# Altium schematic sheet Sheet1.SchDoc
size A3
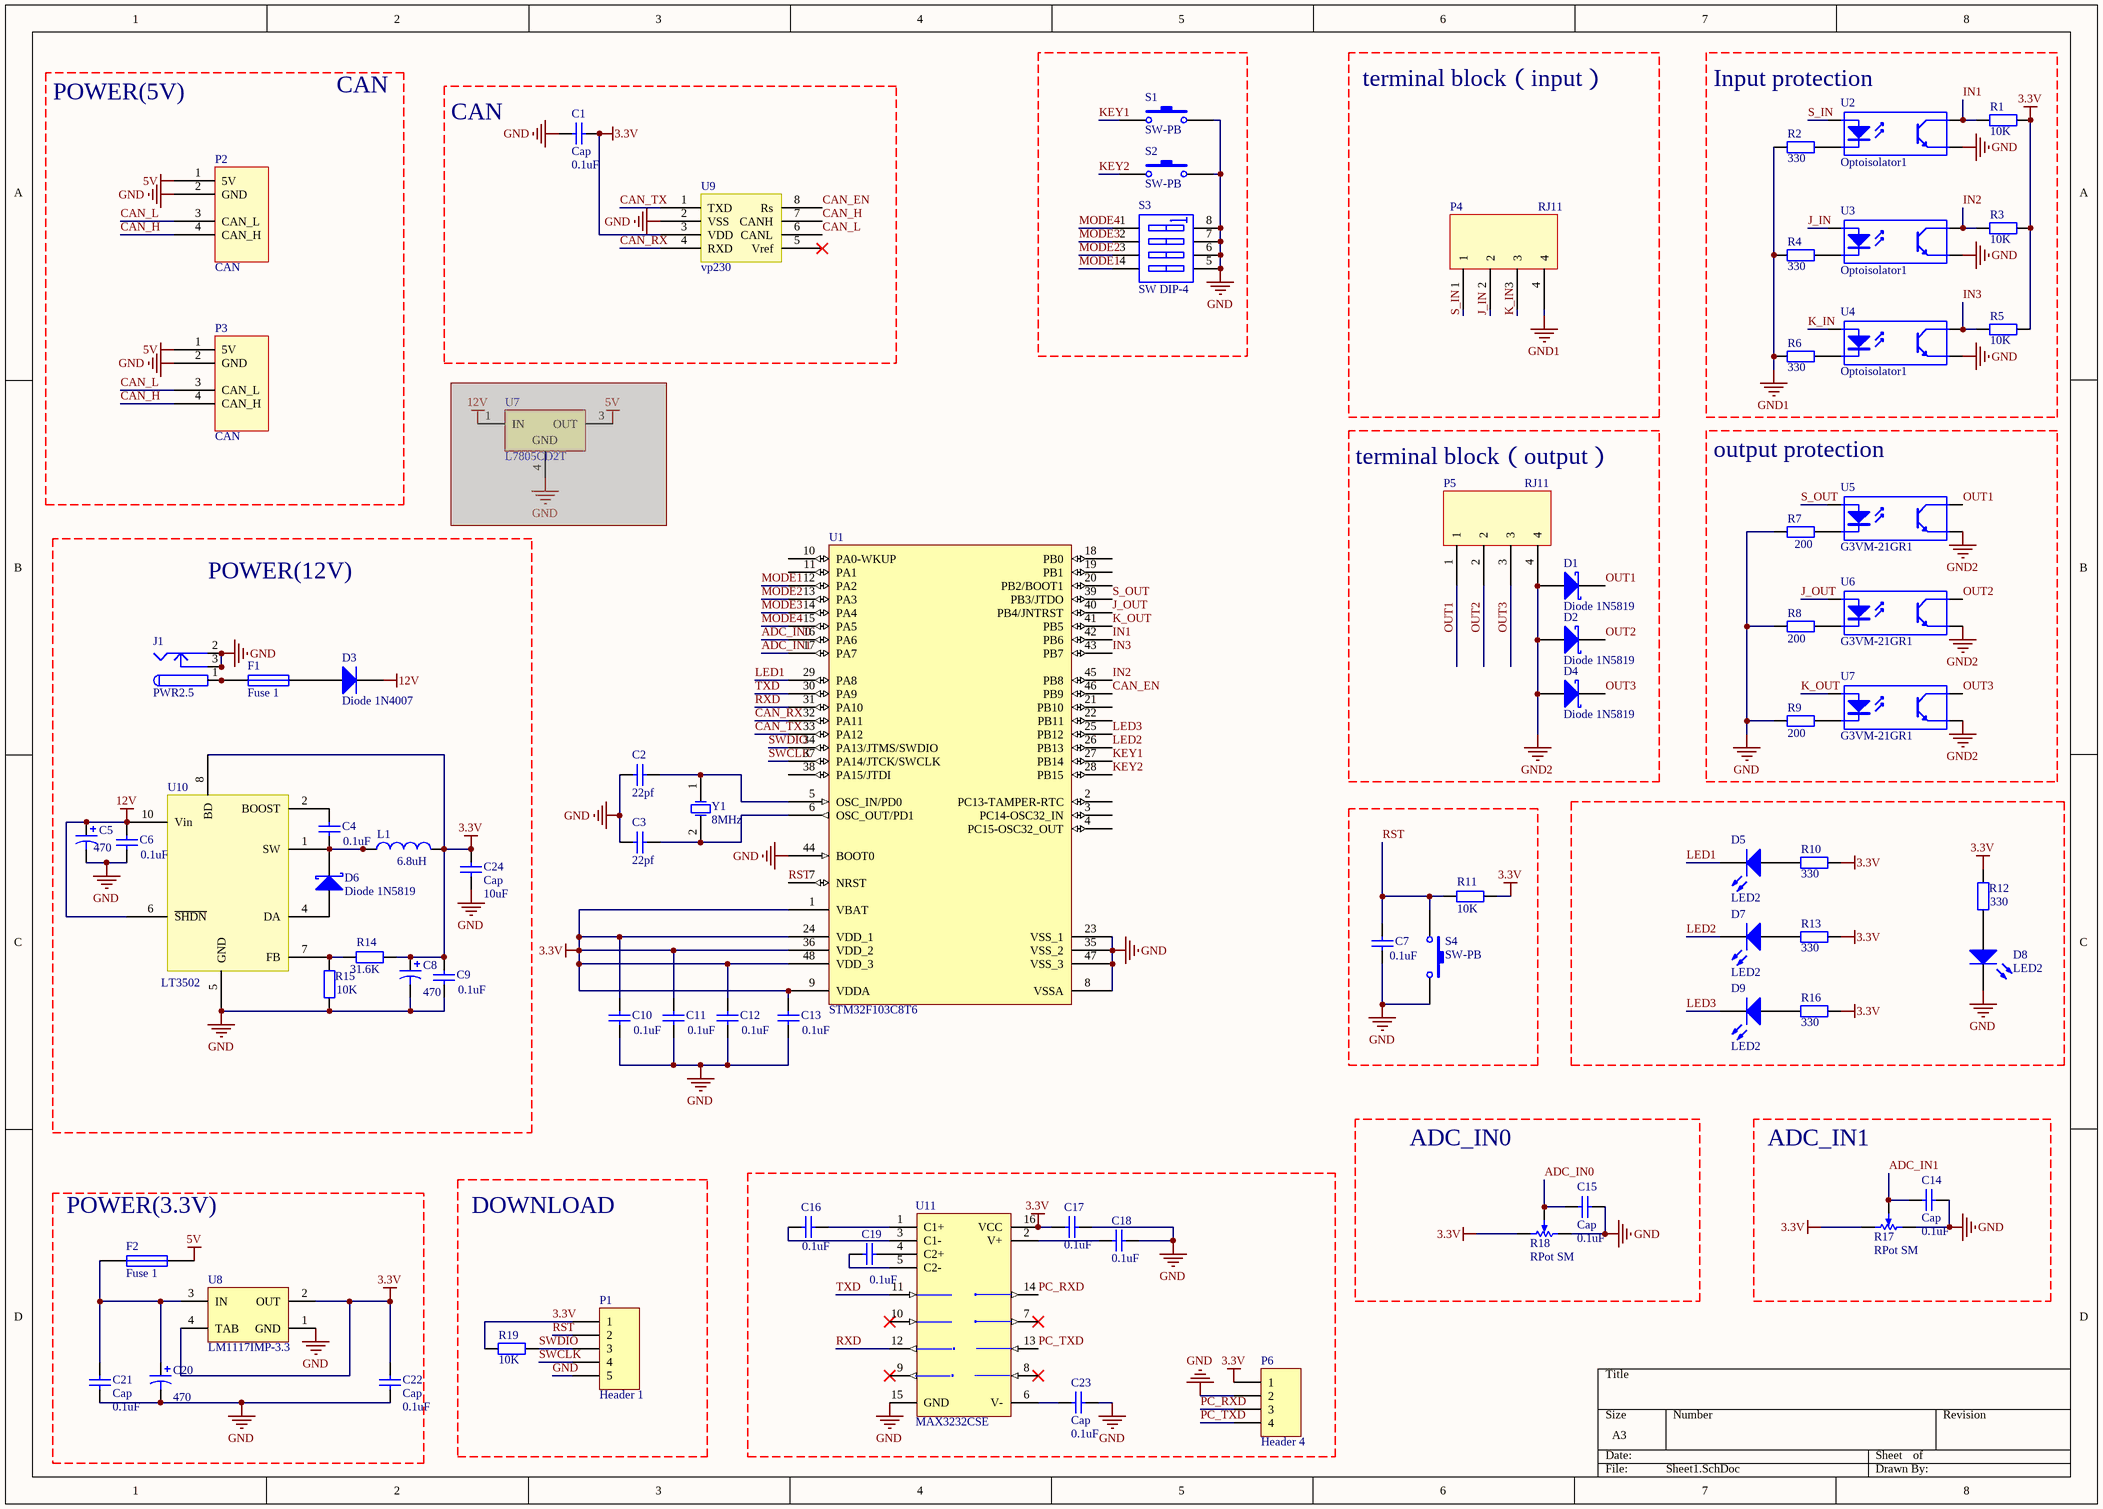
[diagram p0: Sheet1.SchDoc]

## Parts
(Parts that share a designator on the sheet are numbered #1, #2 ... from top to bottom, then left to right.)
C1  Cap  value 0.1uF  [0805]
C2  value 22pf  [0805]  (hidden comment: Cap)
C3  value 22pf  [0805]  (hidden comment: Cap)
C4  value 0.1uF  [0805]  (hidden comment: Cap)
C5  value 470  [CAP]  (hidden comment: Cap Pol1)
C6  value 0.1uF  [0805]  (hidden comment: Cap)
C7  value 0.1uF  [0805]  (hidden comment: Cap)
C8  value 470  [CAP]  (hidden comment: Cap Pol1)
C9  value 0.1uF  [0805]  (hidden comment: Cap)
C10  value 0.1uF  [0805]  (hidden comment: Cap)
C11  value 0.1uF  [0805]  (hidden comment: Cap)
C12  value 0.1uF  [0805]  (hidden comment: Cap)
C13  value 0.1uF  [0805]  (hidden comment: Cap)
C14  Cap  value 0.1uF  [0805]
C15  Cap  value 0.1uF  [0805]
C16  value 0.1uF  [0805]  (hidden comment: Cap)
C17  value 0.1uF  [0805]  (hidden comment: Cap)
C18  value 0.1uF  [0805]  (hidden comment: Cap)
C19  value 0.1uF  [0805]  (hidden comment: Cap)
C20  value 470  [CAP]  (hidden comment: Cap Pol1)
C21  Cap  value 0.1uF  [0805]
C22  Cap  value 0.1uF  [0805]
C23  Cap  value 0.1uF  [0805]
C24  Cap  value 10uF  [1206]
D1  Diode 1N5819  [1N5819]
D2  Diode 1N5819  [1N5819]
D3  Diode 1N4007  [1N4007]
D4  Diode 1N5819  [1N5819]
D5  LED2  [0805_polar]
D6  Diode 1N5819  [1N5819]
D7  LED2  [0805_polar]
D8  LED2  [0805_polar]
D9  LED2  [0805_polar]
F1  Fuse 1  [1812]
F2  Fuse 1  [1812]
J1  PWR2.5  [KLD-0202]
L1  value 6.8uH  [SLF6025]  (hidden comment: Inductor)
P1  Header 1  [HDR1X5]
P2  CAN  [RJ11]
P3  CAN  [RJ11]
P4  RJ11  [RJ11]
P5  RJ11  [RJ11]
P6  Header 4  [HDR1X4]
R1  value 10K  [0805]  (hidden comment: Res2)
R2  value 330  [0805]  (hidden comment: Res2)
R3  value 10K  [0805]  (hidden comment: Res2)
R4  value 330  [0805]  (hidden comment: Res2)
R5  value 10K  [0805]  (hidden comment: Res2)
R6  value 330  [0805]  (hidden comment: Res2)
R7  value 200  [0805]  (hidden comment: Res2)
R8  value 200  [0805]  (hidden comment: Res2)
R9  value 200  [0805]  (hidden comment: Res2)
R10  value 330  [0805]  (hidden comment: Res2)
R11  value 10K  [0805]  (hidden comment: Res2)
R12  value 330  [0805]  (hidden comment: Res2)
R13  value 330  [0805]  (hidden comment: Res2)
R14  value 31.6K  [0805]  (hidden comment: Res2)
R15  value 10K  [0805]  (hidden comment: Res2)
R16  value 330  [0805]  (hidden comment: Res2)
R17  RPot SM  [VR]
R18  RPot SM  [VR]
R19  value 10K  [0805]  (hidden comment: Res2)
S1  SW-PB  [key]
S2  SW-PB  [key]
S3  SW DIP-4  [DIP-8]
S4  SW-PB  [key]
U1  STM32F103C8T6  [LQFP48_N]
U2  Optoisolator1  [SOP4]
U3  Optoisolator1  [SOP4]
U4  Optoisolator1  [SOP4]
U5  G3VM-21GR1  [G3VM-21GR1]
U6  G3VM-21GR1  [G3VM-21GR1]
U7#1  L7805CD2T  [TO-263]  (masked out: inside a compile mask, not in the netlist)
U7#2  G3VM-21GR1  [G3VM-21GR1]
U8  LM1117IMP-3.3  [MP04A_N]
U9  vp230  [SOP8_N]
U10  LT3502  [LT3502]
U11  MAX3232CSE  [NSO16_N]
Y1  8MHz  [XTAL]

## Nets
3.3V: C1.1 C8.1 C9.2 C10.1 C11.1 C12.1 C13.1 C17.1 C22.1 C24.1 L1.2 P1.1 P6.1 R1.1 R3.2 R5.2 R10.1 R11.2 R12.1 R13.1 R14.2 R16.1 R17.1(+) R18.1(+) R19.1 U1.1(VBAT) U1.9(VDDA) U1.24(VDD_1) U1.36(VDD_2) U1.48(VDD_3) U8.2(OUT) U8.4(TAB) U9.3(VDD) U10.8(BD) U11.16(VCC)
5V: F2.1 P2.1(5V) P3.1(5V)
12V: C5.1 C6.2 D3.2(K) U10.6(~{SHDN}) U10.10(NC)
GND: C1.2 C2.2 C3.2 C5.2 C6.1 C7.1 C8.2 C9.1 C10.2 C11.2 C12.2 C13.2 C14.2 C15.2 C17.2 C18.2 C20.2 C21.2 C22.2 C23.2 C24.2 D8.2(K) J1.2 J1.2A J1.2B J1.3 J1.3A J1.3B P1.5 P2.2(GND) P3.2(GND) P6.2 R7.1 R8.1 R9.1 R15.1 R17.2(-) R18.2(-) S1.2 S2.2 S3.5(B4) S3.6(B3) S3.7(B2) S3.8(B1) S4.2 U1.8(VSSA) U1.23(VSS_1) U1.35(VSS_2) U1.44(BOOT0) U1.47(VSS_3) U2.3(E) U3.3(E) U4.3(E) U8.1(GND) U9.2(VSS) U10.5(GND) U11.15(GND)
GND1: P4.4 R2.1 R4.1 R6.1
GND2: D1.1(A) D2.1(A) D4.1(A) P5.4 U5.3(E) U6.3(E) U7#2.3(E)
ADC_IN0: C15.1 R18.3(W) U1.16(PA6)
ADC_IN1: C14.1 R17.3(W) U1.17(PA7)
CAN_EN: U1.46(PB9) U9.8(Rs)
CAN_H: P2.4(CAN_H) P3.4(CAN_H) U9.7(CANH)
CAN_L: P2.3(CAN_L) P3.3(CAN_L) U9.6(CANL)
CAN_RX: U1.32(PA11) U9.4(RXD)
CAN_TX: U1.33(PA12) U9.1(TXD)
IN1: R1.2 U1.42(PB6) U2.4(C)
IN2: R3.1 U1.45(PB8) U3.4(C)
IN3: R5.1 U1.43(PB7) U4.4(C)
J_IN: P4.2 U3.1(A)
J_OUT: U1.40(PB4/JNTRST) U6.1(A)
K_IN: P4.3 U4.1(A)
K_OUT: U1.41(PB5) U7#2.1(A)
KEY1: S1.1 U1.27(PB14)
KEY2: S2.1 U1.28(PB15)
LED1: D5.2(K) U1.29(PA8)
LED2: D7.2(K) U1.26(PB13)
LED3: D9.2(K) U1.25(PB12)
MODE1: S3.4(A4) U1.12(PA2)
MODE2: S3.3(A3) U1.13(PA3)
MODE3: S3.2(A2) U1.14(PA4)
MODE4: S3.1(A1) U1.15(PA5)
OUT1: D1.2(K) P5.1 U5.4(C)
OUT2: D2.2(K) P5.2 U6.4(C)
OUT3: D4.2(K) P5.3 U7#2.4(C)
PC_RXD: P6.3 U11.14(T1OUT)
PC_TXD: P6.4 U11.13(R1IN)
RST: C7.2 P1.2 R11.1 S4.1 U1.7(NRST)
RXD: U1.31(PA10) U11.12(R1OUT)
S_IN: P4.1 U2.1(A)
S_OUT: U1.39(PB3/JTDO) U5.1(A)
SWCLK: P1.4 U1.37(PA14/JTCK/SWCLK)
SWDIO: P1.3 R19.2 U1.34(PA13/JTMS/SWDIO)
TXD: U1.30(PA9) U11.11(T1IN)
NetC2_1: C2.1 U1.5(OSC_IN/PD0) Y1.1(OSC1)
NetC3_1: C3.1 U1.6(OSC_OUT/PD1) Y1.2(OSC2)
NetC4_1: C4.1 D6.2(K) L1.1 U10.1(SW)
NetC4_2: C4.2 U10.2(BOOST)
NetC16_1: C16.1 U11.3(C1-)
NetC16_2: C16.2 U11.1(C1+)
NetC18_1: C18.1 U11.2(V+)
NetC19_1: C19.1 U11.5(C2-)
NetC19_2: C19.2 U11.4(C2+)
NetC20_1: C20.1 C21.1 F2.2 U8.3(IN)
NetC23_1: C23.1 U11.6(V-)
NetD3_1: D3.1(A) F1.2
NetD5_1: D5.1(A) R10.2
NetD6_1: D6.1(A) U10.4(DA)
NetD7_1: D7.1(A) R13.2
NetD8_1: D8.1(A) R12.2
NetD9_1: D9.1(A) R16.2
NetF1_1: F1.1 J1.1 J1.1A J1.1B
NetR2_2: R2.2 U2.2(K)
NetR4_2: R4.2 U3.2(K)
NetR6_2: R6.2 U4.2(K)
NetR7_2: R7.2 U5.2(K)
NetR8_2: R8.2 U6.2(K)
NetR9_2: R9.2 U7#2.2(K)
NetR14_1: R14.1 R15.2 U10.7(FB)

Not connected (* = marked no-connect by the designer): U1 2(PC13-TAMPER-RTC) 3(PC14-OSC32_IN) 4(PC15-OSC32_OUT) 10(PA0-WKUP) 11(PA1) 18(PB0) 19(PB1) 20(PB2/BOOT1) 21(PB10) 22(PB11) 38(PA15/JTDI); U9 5(Vref)*; U10 3(NC) 9(NC) 12(NC); U11 7(T2OUT)* 8(R2IN)* 9(R2OUT)* 10(T2IN)*

## Notes on the sheet
- POWER(5V)
- CAN
- terminal block（input）
- (near U2) Input protection
- terminal block（output）
- (near U5) output protection
- POWER(12V)
- ADC_IN0
- ADC_IN1
- (near F2) POWER(3.3V)
- DOWNLOAD

## Library data of the parts
C1-C4 C6 C7 C9-C19 C21-C24 = Cap: Capacitor; Published: 8-Jun-2000; LatestRevisionDate: 17-Jul-2002; LatestRevisionNote: Re-released for DXP Platform.; PackageReference: RAD-0.3; Publisher: Altium Limited
C5 C8 C20 = Cap Pol1: Polarized Capacitor (Radial); Published: 8-Jun-2000; LatestRevisionDate: 17-Jul-2002; LatestRevisionNote: Re-released for DXP Platform.; PackageReference: RB7.6-15; Publisher: Altium Limited
D1 D2 D4 D6 = Diode 11DQ03: Schottky Rectifier; Published: 8-Jun-2000; LatestRevisionDate: 17-Jul-2002; LatestRevisionNote: Re-released for DXP Platform.; DatasheetVersion: Dec-1997; PackageReference: DO-204AL; Publisher: Altium Limited; Code_JEDEC: DO-204-AL; ComponentLink1Description: Manufacturer Link; ComponentLink1URL: http://www.irf.com/; ComponentLink2Description: Datasheet; ComponentLink2URL: http://www.irf.com/product-info/datasheets/data/11dq03.pdf
D3 = Diode 1N4007: 1 Amp General Purpose Rectifier; Published: 8-Jun-2000; LatestRevisionDate: 17-Jul-2002; LatestRevisionNote: Re-released for DXP Platform.; DatasheetVersion: 1998; PackageVersion: Aug-1999; PackageReference: DO-41; Publisher: Altium Limited; Code_JEDEC: DO-204-AL; ComponentLink1Description: Manufacturer Link; ComponentLink1URL: http://www.fairchildsemi.com/; ComponentLink2Description: Datasheet; ComponentLink2URL: http://www.fairchildsemi.com/ds/1N%2F1N4001.pdf
D5 D7-D9 = LED2: Typical RED, GREEN, YELLOW, AMBER GaAs LED; Published: 8-Jun-2000; LatestRevisionDate: 17-Jul-2002; LatestRevisionNote: Re-released for DXP Platform.; PackageVersion: Feb-2002; PackageReference: 3.2X1.6X1.1; Publisher: Altium Limited
F1 F2 = Fuse 1: Fuse; Published: 8-Jun-2000; LatestRevisionDate: 17-Jul-2002; LatestRevisionNote: Re-released for DXP Platform.; PackageReference: PIN-W2/E2.8; Publisher: Altium Limited
J1 = PWR2.5: Low Voltage Power Supply Connector; Published: 17-Dec-2003; DatasheetDocument: 09-May-2002; Publisher: Altium Limited; ComponentLink1Description: Manufacturer Link; ComponentLink1URL: http://domino.kycon.com/internet/Products.html
L1 = Inductor: Code_IEC: 1005; Published: 8-Jun-2000; LatestRevisionDate: 29-May-2009; LatestRevisionNote: IPC-7351 Footprint Added.; PackageReference: 0402-A; Publisher: Altium Limited; PackageDescription: Chip Inductor; Code_JEITA: 0402
P1 = Header 5: Header, 5-Pin; LatestRevisionDate: 17-Jul-2002; LatestRevisionNote: Re-released for DXP Platform.; Publisher: Altium Limited
P6 = Header 4: Header, 4-Pin; LatestRevisionDate: 17-Jul-2002; LatestRevisionNote: Re-released for DXP Platform.; Publisher: Altium Limited
R1-R16 R19 = Res2: Resistor; Published: 8-Jun-2000; LatestRevisionDate: 17-Jul-2002; LatestRevisionNote: Re-released for DXP Platform.; PackageReference: AXIAL-0.4; Publisher: Altium Limited
R17 R18 = RPot SM: Square Trimming Potentiometer; Published: 17-Dec-2003; DatasheetVersion: Oct-2003; PackageReference: POT4MM-2; Publisher: Altium Limited; ComponentLink1Description: Manufacturer Link; ComponentLink1URL: http://bourns.com/2/search.html
S1 S2 S4 = SW-PB: Switch; Published: 24-Mar-1999; LatestRevisionDate: 17-Jul-2002; LatestRevisionNote: Re-released for DXP Platform.; PackageReference: SPST-2; Publisher: Altium Limited
S3 = SW DIP-4: DIP Switch, 4 Position, SPST; Published: 24-Mar-1999; LatestRevisionDate: 29-May-2009; LatestRevisionNote: IPC-7351 Footprint Added.; PackageVersion: Dec-2002; PackageReference: SO8; Publisher: Altium Limited; PackageDescription: 8-Pin Small Outline Integrated Circuit 1.27 mm Pitch; Code_JEDEC: MS-012-AA; Code_IPC: SOIC127P600-8
U1 = STM32F103C8T6: STM32 ARM-based 32-bit MCU with 64 Kbytes Flash, 48-pin LQFP, Industrial Temperature; Published: 30-May-2008; DatasheetVersion: rev6, Mar-2008; PackageVersion: Mar-2008; PackageReference: LQFP48; Publisher: Altium Limited; PackageDescription: 48-Pin Low-Profile Quad Flat Pack, 7 x 7 mm Body, 0.5 mm Pitch (LQFP48); ComponentLink1Description: Manufacturer Link; ComponentLink1URL: www.st.com/stm32; ComponentLink2Description: Datasheet; ComponentLink2URL: http://www.st.com/stonline/products/literature/ds/13587.pdf
U2-U4 = Optoisolator1: 4-Pin Phototransistor Optocoupler; Published: 24-Mar-1999; LatestRevisionDate: 04-Mar-2005; LatestRevisionNote: Sch pins 3 & 4 Swapped.; DatasheetVersion: Nov-2003; PackageReference: DIP-4; Publisher: Altium Limited
U7#1 = L7805CD2T: Positive Voltage Regulator; Published: 24-Aug-2001; LatestRevisionDate: 17-Jul-2002; LatestRevisionNote: Re-released for DXP Platform.; DatasheetVersion: Dec-1998; PackageReference: TO-263; Publisher: Altium Limited; PackageDescription: D2-PAK/TO-263-AB; 3 Leads (1 Cropped); Body 15.9 (inc. leads) x 10.4 mm (LxW max); ComponentLink1Description: Manufacturer Link; ComponentLink1URL: http://www.st.com/
U8 = LM1117IMP-3.3: 800mA Low-Dropout Linear Regulator; Manufacturer: National Semiconductor; CompType: LDO IC; PackageTopMarking: XYTT*N05B; PowerWise: N; Published: 4-Dec-2008; DatasheetVersion: Apr-2006; PackageVersion: revB, Apr-2003; PackageReference: MP04A; Publisher: Altium Limited; PackageDescription: Molded SOT-223, 6.50 x 3.56 x 1.6mm Body, 4 Lead, 2.3mm Pitch; PartNumber: LM1117IMP-3.3; RoHS: O; PinCount: 4; DigiKeyPartNumber: LM1117IMP-3.3CT-ND; Code_JEDEC: TO-261-AA; Code_IPC: SOT223-4; ComponentLink1Description: LM1117 Datasheet; ComponentLink1URL: http://www.national.com/ds/LM/LM1117.pdf; ComponentLink2Description: LM1117 Web Page; ComponentLink2URL: http://www.national.com/pf/LM/LM1117.html; ComponentLink3Description: MP04A Package Page; ComponentLink3URL: http://www.national.com/packaging/folders/mp04a.html
U11 = MAX3232CSE: 3.0V TO 5.5V, Low-Power, up to 1Mbps, True RS-232 Transceiver Using Four 0.1µF External Capacitor; Published: 16-Jan-2001; LatestRevisionDate: 13-Apr-2006; LatestRevisionNote: IPC-7351 Footprint Added.; DatasheetVersion: Mar-1999; PackageReference: NSO16; Publisher: Altium Limited; PackageDescription: 16-Pin Small Outline Integrated Circuit 1.27 mm Pitch; Code_JEDEC: MS-012-AC; Code_IPC: SOIC127P600-16; ComponentLink1Description: Manufacturer Link; ComponentLink1URL: http://www.maxim-ic.com/; ComponentLink2Description: Datasheet; ComponentLink2URL: http://pdfserv.maxim-ic.com/en/ds/MAX3222-MAX3241.pdf
Y1 = XTAL: Crystal Oscillator; Published: 8-Jun-2000; LatestRevisionDate: 17-Jul-2002; LatestRevisionNote: Re-released for DXP Platform.; PackageReference: R38; Publisher: Altium Limited